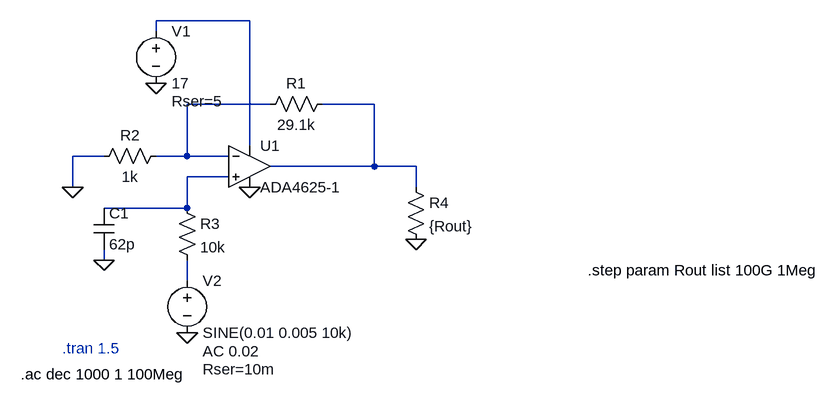
[diagram p0: schematic symulacje częstotliwościowe.asc]
symulacje częstotliwościowe.asc, the LTspice schematic file:
Version 4
SHEET 1 1096 680
WIRE 192 -64 48 -64
WIRE 48 -48 48 -64
WIRE 224 64 96 64
WIRE 384 64 304 64
WIRE 192 128 192 -64
WIRE -32 144 -80 144
WIRE 96 144 96 64
WIRE 96 144 48 144
WIRE 160 144 96 144
WIRE 384 160 384 64
WIRE 384 160 224 160
WIRE 448 160 384 160
WIRE 160 176 96 176
WIRE -80 192 -80 144
WIRE 448 192 448 160
WIRE 96 224 96 176
WIRE 96 224 -32 224
WIRE -32 304 -32 288
WIRE 96 336 96 304
FLAG 48 32 0
FLAG 192 192 0
FLAG -32 304 0
FLAG 96 416 0
FLAG -80 192 0
FLAG 448 272 0
SYMBOL OpAmps\\ADA4625-1 192 96 R0
SYMATTR InstName U1
SYMBOL res 320 48 R90
WINDOW 0 0 56 VBottom 2
WINDOW 3 32 56 VTop 2
SYMATTR InstName R1
SYMATTR Value 29.1k
SYMBOL res 64 128 R90
WINDOW 0 0 56 VBottom 2
WINDOW 3 32 56 VTop 2
SYMATTR InstName R2
SYMATTR Value 1k
SYMBOL voltage 48 -64 R0
WINDOW 123 0 0 Left 0
WINDOW 39 24 124 Left 2
SYMATTR SpiceLine Rser=5
SYMATTR InstName V1
SYMATTR Value 17
SYMBOL res 80 208 R0
SYMATTR InstName R3
SYMATTR Value 10k
SYMBOL cap -48 224 R0
SYMATTR InstName C1
SYMATTR Value 62p
SYMBOL res 432 176 R0
SYMATTR InstName R4
SYMATTR Value {Rout}
SYMBOL voltage 96 320 R0
WINDOW 123 24 124 Left 2
WINDOW 39 24 152 Left 2
SYMATTR Value2 AC 0.02
SYMATTR SpiceLine Rser=10m
SYMATTR InstName V2
SYMATTR Value SINE(0.01 0.005 10k)
TEXT -96 440 Left 2 ;.tran 1.5
TEXT 712 320 Left 2 !.step param Rout list 100G 1Meg
TEXT -160 480 Left 2 !.ac dec 1000 1 100Meg

The netlist it stands for:
* symulacje częstotliwościowe.asc
XU1 N004 N002 N001 0 N003 ADA4625-1  ; pins In+ In- V+ V- OUT
R1 N003 N002 29.1k
R2 N002 0 1k
V1 N001 0 17 Rser=5
R3 N004 N005 10k
C1 N004 0 62p
R4 N003 0 {Rout}
V2 N005 0 SINE(0.01 0.005 10k) AC 0.02 Rser=10m
* .tran 1.5
.step param Rout list 100G 1Meg
.ac dec 1000 1 100Meg
.backanno
.end